# Altium schematic sheet Power.SchDoc: LEDDRV_POWER
size A4; Author: Theprocyon; SheetNumber: 1; SheetTotal: 3
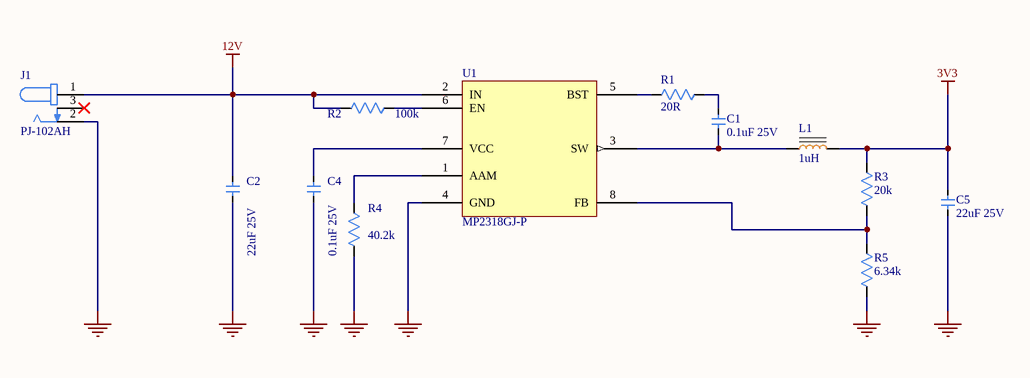
[diagram p0: Power.SchDoc]

## Parts
C1  0.1uF 25V  [CAP 0402_1005]
C2  22uF 25V  [CAP 1206_3216]
C4  0.1uF 25V  [CAP 0402_1005]
C5  22uF 25V  [CAP 1206_3216]
J1  PJ-102AH  [CUI_PJ-102AH]
L1  1uH  [IND_SRN2012T_BRN]
R1  20R  [RES 0402_1005]
R2  100k  [RES 0402_1005]
R3  20k  [RES 0402_1005]
R4  40.2k  [RES 0402_1005]
R5  6.34k  [RES 0402_1005]
U1  MP2318GJ-P  [TSOT23-8_MP2318_MNP]

## Nets
3V3: C5.2 L1.2 R3.2
12V: C2.2 J1.1 R2.2 U1.2(IN)
GND: C2.1 C4.1 C5.1 J1.2 R4.1 R5.1 U1.4(GND)
NetC1_1: C1.1 L1.1 U1.3(SW)
NetC1_2: C1.2 R1.1
NetC4_2: C4.2 U1.7(VCC)
NetR1_2: R1.2 U1.5(BST)
NetR2_1: R2.1 U1.6(EN)
NetR3_1: R3.1 R5.2 U1.8(FB)
NetR4_2: R4.2 U1.1(AAM)

Not connected (* = marked no-connect by the designer): J1 3*

## Notes on the sheet
- Title
- Number:
- Date:
- Revision:
- Sheet
- of
- Author
- Security
- Doc Size
- A4
- File:

## Library data of the parts
C1 C2 C4 C5 = Capacitor: SMT Capacitor
  C1 C4: Value: 0.1uF 25V
  C2 C5: Value: 22uF 25V
J1 = PJ-102AH: 2.0 mm Center Pin, 5.0 A, Right Angle, Through Hole, Tapered Pins, Dc Power Jack Connector, Barrel Jack; Full Part Number: PJ-102AH
L1 = Inductor Core: SMD Inductor with Core; Full Part Number: LQM2MPN1R0MGHL; Value: 1uH
R1-R5 = Resistor: SMT Resistor
  R1: Value: 20R
  R2: Value: 100k
  R3: Value: 20k
  R4: Value: 40.2k
  R5: Value: 6.34k
U1 = MP2318GJ-P: No Description Available; Mfr_Name: Monolithic Power Systems; RefDes: RefDes; Type: Type; Full part number: MP2318GJ